# EAGLE design smart_stirrer_proto_mk2 (EAGLE 9.1.1)
CNAME: Smart Stirrer Prototype; CREVISION: MARK 2

## Sheet 1 of 3: MCU and ADC
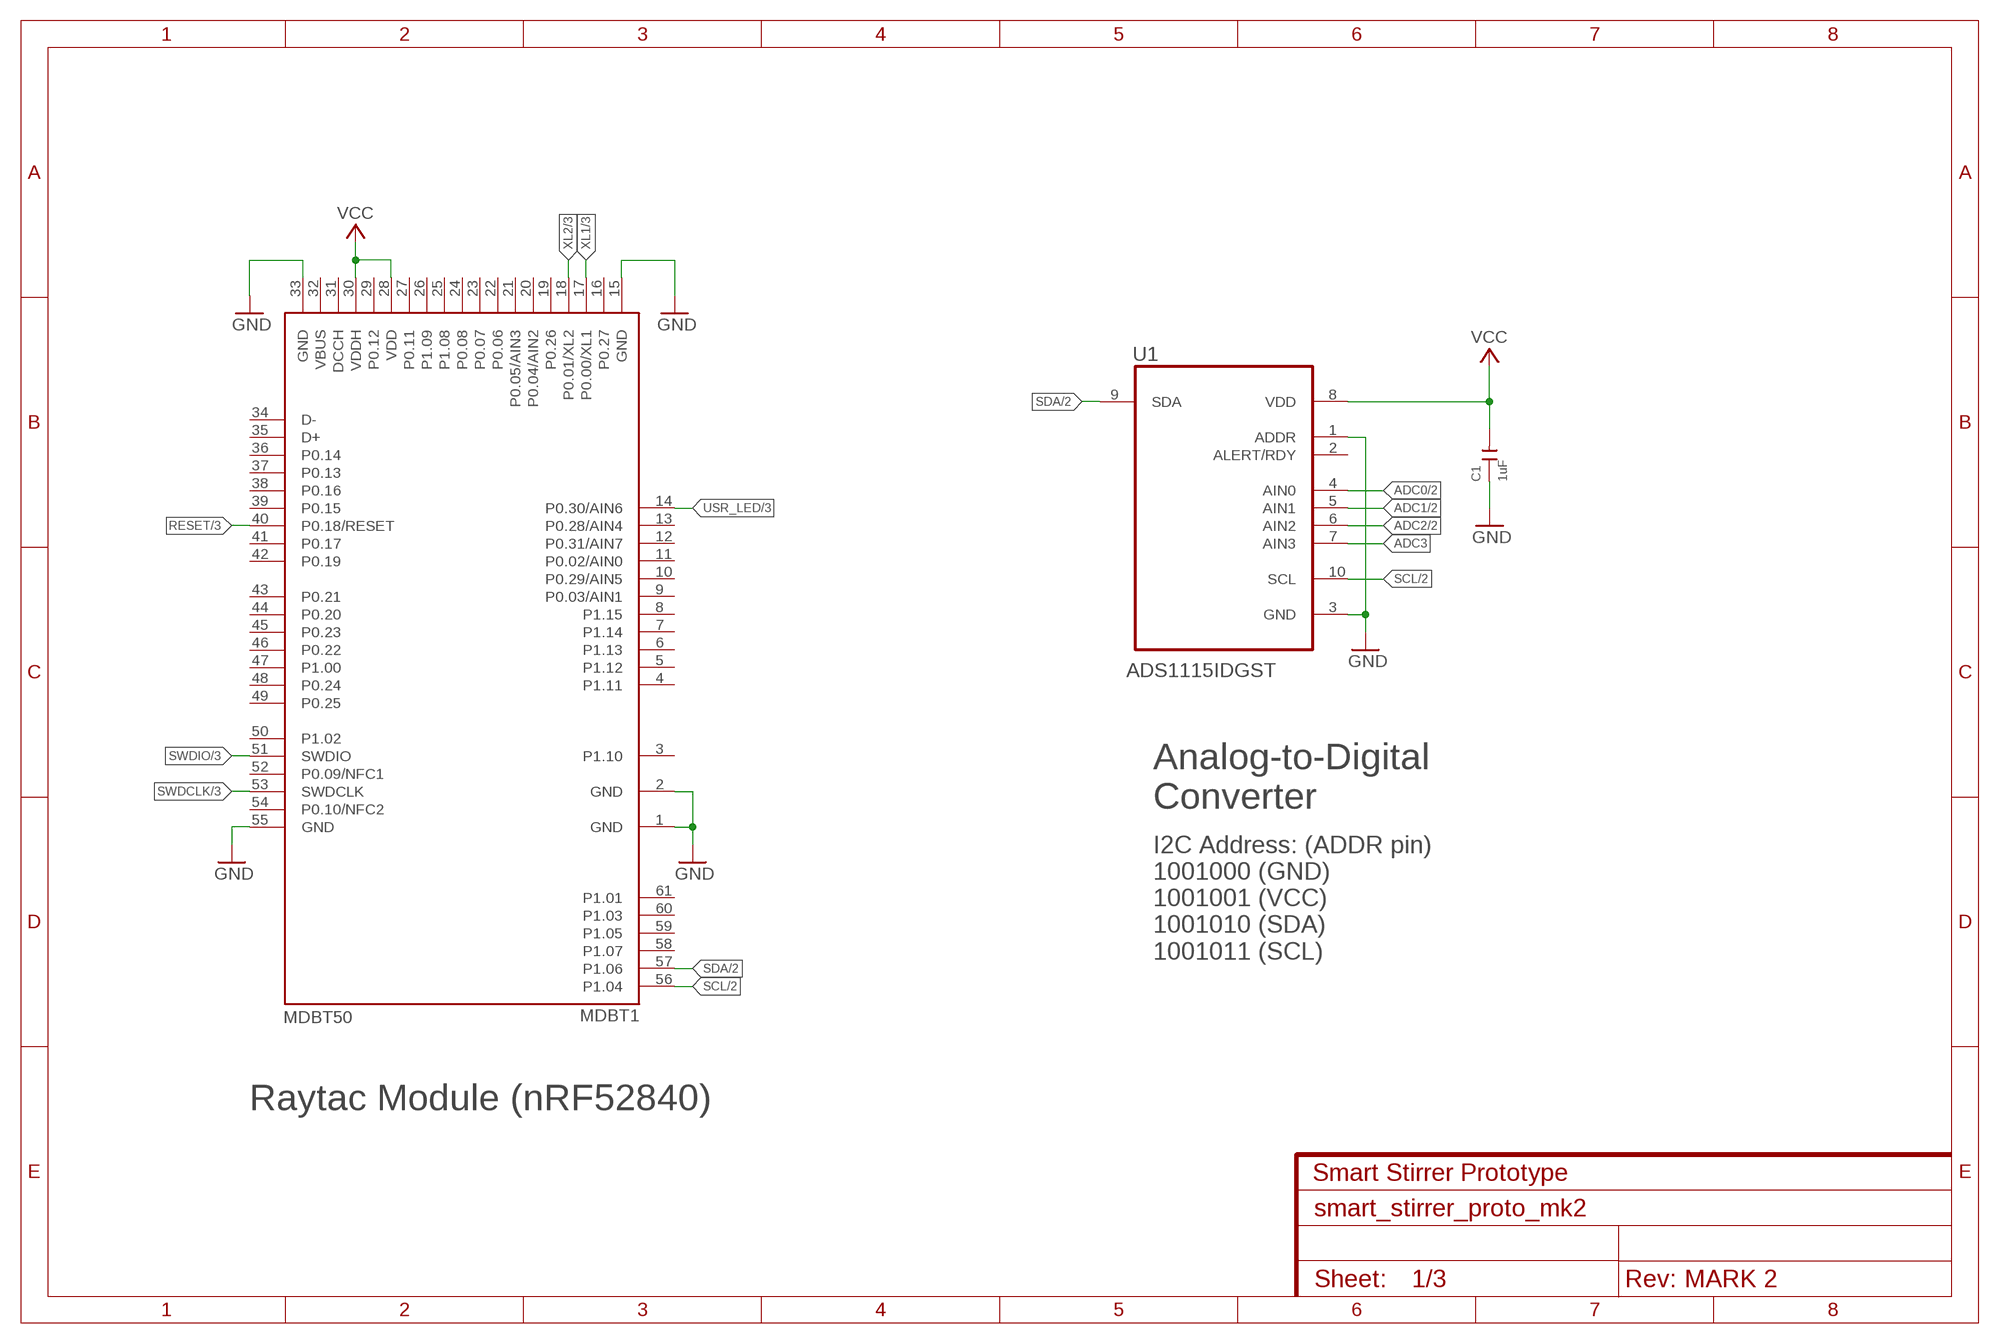
[diagram p0: schematic, sheet 1]

### Parts
C1  1uF  CERAMIC-1UF-10V-10%-X5R(0402)  [C0402]
MDBT1  MDBT50  [MDBT50]
U1  ADS1115IDGST  [SOP50P490X110-10N]

### Nets
ADC0: U1.4(AIN0) ; also sheet 2
ADC1: U1.5(AIN1) ; also sheet 2
ADC2: U1.6(AIN2) ; also sheet 2
ADC3: U1.7(AIN3)
GND: C1.1 MDBT1.1(GND) MDBT1.2(GND) MDBT1.15(GND) MDBT1.33(GND) MDBT1.55(GND) U1.1(ADDR) U1.3(GND) ; also sheet 2,3
RESET: MDBT1.40(P0.18/RESET) ; also sheet 3
SCL: MDBT1.56(P1.04) U1.10(SCL) ; also sheet 2,3
SDA: MDBT1.57(P1.06) U1.9(SDA) ; also sheet 2,3
SWDCLK: MDBT1.53(SWDCLK) ; also sheet 3
SWDIO: MDBT1.51(SWDIO) ; also sheet 3
USR_LED: MDBT1.14(P0.30/AIN6) ; also sheet 3
VCC: C1.2 MDBT1.28(VDD) MDBT1.30(VDDH) U1.8(VDD) ; also sheet 2,3
XL1: MDBT1.17(P0.00/XL1) ; also sheet 3
XL2: MDBT1.18(P0.01/XL2) ; also sheet 3
Unconnected: MDBT1.3(P1.10) MDBT1.4(P1.11) MDBT1.5(P1.12) MDBT1.6(P1.13) MDBT1.7(P1.14) MDBT1.8(P1.15) MDBT1.9(P0.03/AIN1) MDBT1.10(P0.29/AIN5) MDBT1.11(P0.02/AIN0) MDBT1.12(P0.31/AIN7) MDBT1.13(P0.28/AIN4) MDBT1.16(P0.27) MDBT1.19(P0.26) MDBT1.20(P0.04/AIN2) MDBT1.21(P0.05/AIN3) MDBT1.22(P0.06) MDBT1.23(P0.07) MDBT1.24(P0.08) MDBT1.25(P1.08) MDBT1.26(P1.09) MDBT1.27(P0.11) MDBT1.29(P0.12) MDBT1.31(DCCH) MDBT1.32(VBUS) MDBT1.34(D-) MDBT1.35(D+) MDBT1.36(P0.14) MDBT1.37(P0.13) MDBT1.38(P0.16) MDBT1.39(P0.15) MDBT1.41(P0.17) MDBT1.42(P0.19) MDBT1.43(P0.21) MDBT1.44(P0.20) MDBT1.45(P0.23) MDBT1.46(P0.22) MDBT1.47(P1.00) MDBT1.48(P0.24) MDBT1.49(P0.25) MDBT1.50(P1.02) MDBT1.52(P0.09/NFC1) MDBT1.54(P0.10/NFC2) MDBT1.58(P1.07) MDBT1.59(P1.05) MDBT1.60(P1.03) MDBT1.61(P1.01) U1.2(ALERT/RDY)

### Notes on the sheet
- Analog-to-Digital
  Converter
- I2C Address: (ADDR pin)
  1001000 (GND)
  1001001 (VCC)
  1001010 (SDA)
  1001011 (SCL)
- Raytac Module (nRF52840)

## Sheet 2 of 3: Sensors
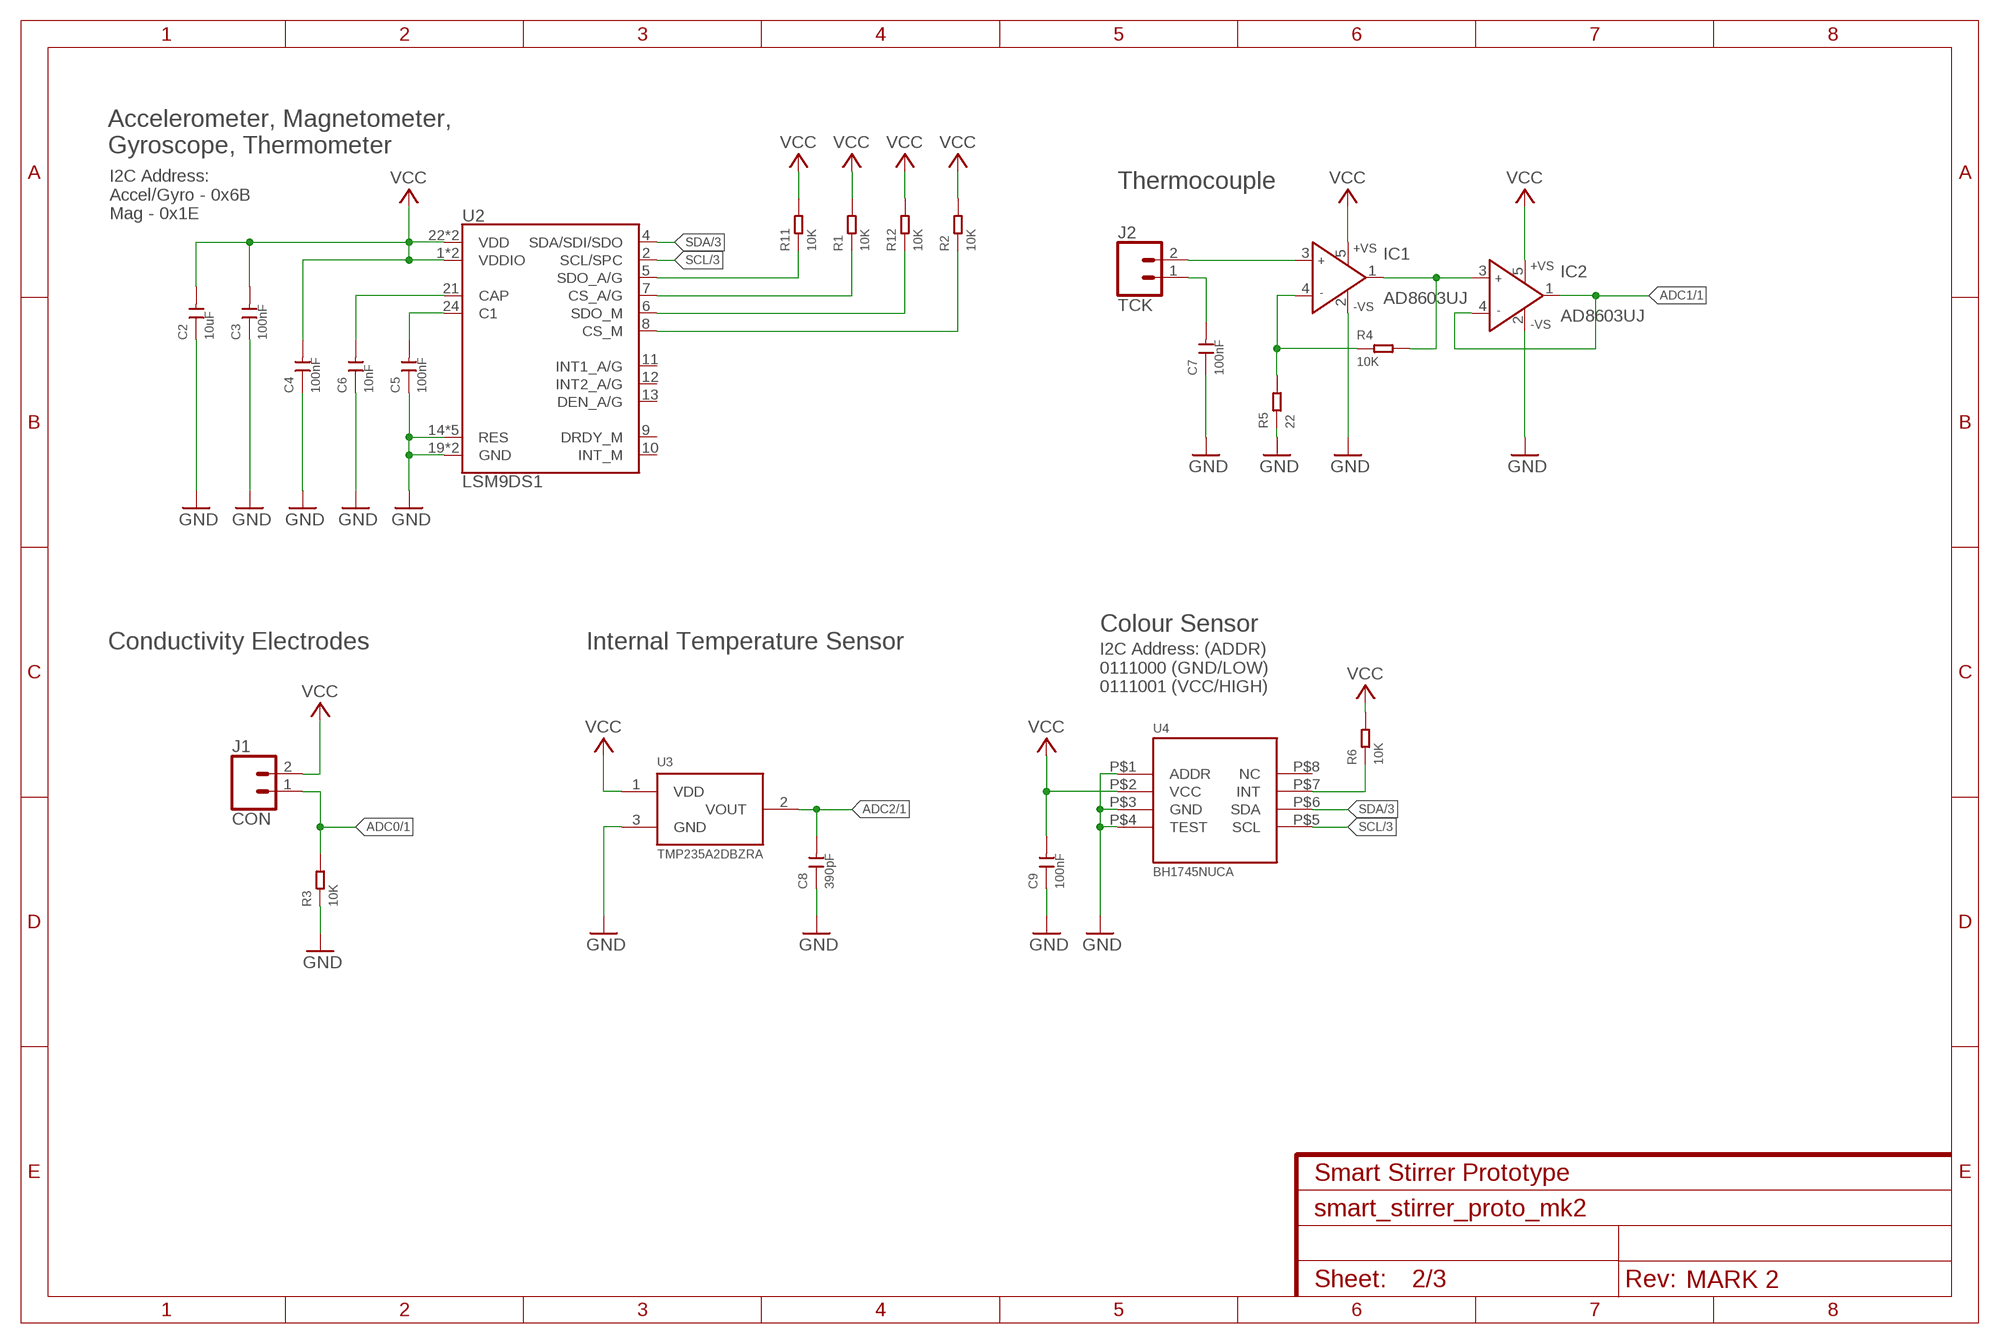
[diagram p1: schematic, sheet 2]

### Parts
C2  10uF  CERAMIC-10UF-6.3V-20%-X5R(0402)  [C0402]
C3  100nF  CERAMIC-100NF-25V-10%-X7R(0402)  [C0402]
C4  100nF  CERAMIC-100NF-25V-10%-X7R(0402)  [C0402]
C5  100nF  CERAMIC-100NF-25V-10%-X7R(0402)  [C0402]
C6  10nF  CERAMIC-10NF-50V-10%-X7R(0402)  [C0402]
C7  100nF  CERAMIC-100NF-25V-10%-X7R(0402)  [C0402]
C8  390pF  CERAMIC-390PF-50V-10%-X7R(0402)  [C0402]
C9  100nF  CERAMIC-100NF-25V-10%-X7R(0402)  [C0402]
IC1  AD8603UJ  [SOT23-5]
IC2  AD8603UJ  [SOT23-5]
J1  CON  CONN_021X02_NO_SILK  [1X02_NO_SILK]
J2  TCK  CONN_021X02_NO_SILK  [1X02_NO_SILK]
R1  10K  SMD-RES-10K-5%-1/(0402)  [R0402]
R2  10K  SMD-RES-10K-5%-1/(0402)  [R0402]
R3  10K  SMD-RES-10K-5%-1/(0402)  [R0402]
R4  10K  SMD-RES-10K-5%-1/(0402)  [R0402]
R5  22  SMD-RES-22R-5%-1/16W(0402)  [R0402]
R6  10K  SMD-RES-10K-5%-1/(0402)  [R0402]
R11  10K  SMD-RES-10K-5%-1/(0402)  [R0402]
R12  10K  SMD-RES-10K-5%-1/(0402)  [R0402]
U2  LSM9DS1  [LGA24-8X4]
U3  TMP235A2DBZRA  [SOT-23-3]
U4  BH1745NUCA  [BH1745NUC-E2]

### Nets
ADC0: J1.1 R3.2 ; also sheet 1
ADC1: IC2.1(OUT) IC2.4(IN-) ; also sheet 1
ADC2: C8.2 U3.2(VOUT) ; also sheet 1
GND: C2.1 C3.1 C4.1 C5.1 C6.1 C7.1 C8.1 C9.1 IC1.2(-VS) IC2.2(-VS) R3.1 R5.1 U2.14(RES) U2.15(RES) U2.16(RES) U2.17(RES) U2.18(RES) U2.19(GND) U2.20(GND) U3.3(GND) U4.P$1(ADDR) U4.P$3(GND) U4.P$4(TEST) ; also sheet 1,3
N$1: C5.2 U2.24(C1)
N$2: C6.2 U2.21(CAP)
N$3: IC1.1(OUT) IC2.3(IN+) R4.2
N$4: R1.1 U2.7(CS_A/G)
N$5: R2.1 U2.8(CS_M)
N$6: IC1.3(IN+) J2.2
N$7: IC1.4(IN-) R4.1 R5.2
N$8: C7.2 J2.1
N$9: R6.1 U4.P$7(INT)
N$11: R11.1 U2.5(SDO_A/G)
N$12: R12.1 U2.6(SDO_M)
SCL: U2.2(SCL/SPC) U4.P$5(SCL) ; also sheet 1,3
SDA: U2.4(SDA/SDI/SDO) U4.P$6(SDA) ; also sheet 1,3
VCC: C2.2 C3.2 C4.2 C9.2 IC1.5(+VS) IC2.5(+VS) J1.2 R1.2 R2.2 R6.2 R11.2 R12.2 U2.1(VDDIO) U2.3(VDDIO) U2.22(VDD) U2.23(VDD) U3.1(VDD) U4.P$2(VCC) ; also sheet 1,3
Unconnected: U2.9(DRDY_M) U2.10(INT_M) U2.11(INT1_A/G) U2.12(INT2_A/G) U2.13(DEN_A/G) U4.P$8(NC)

### Notes on the sheet
- Accelerometer, Magnetometer,
  Gyroscope, Thermometer
- Thermocouple
- I2C Address: 
  Accel/Gyro - 0x6B
  Mag - 0x1E
- Colour Sensor
- Conductivity Electrodes | Internal Temperature Sensor
- I2C Address: (ADDR)
  0111000 (GND/LOW)
  0111001 (VCC/HIGH)

## Sheet 3 of 3: Power and Headers
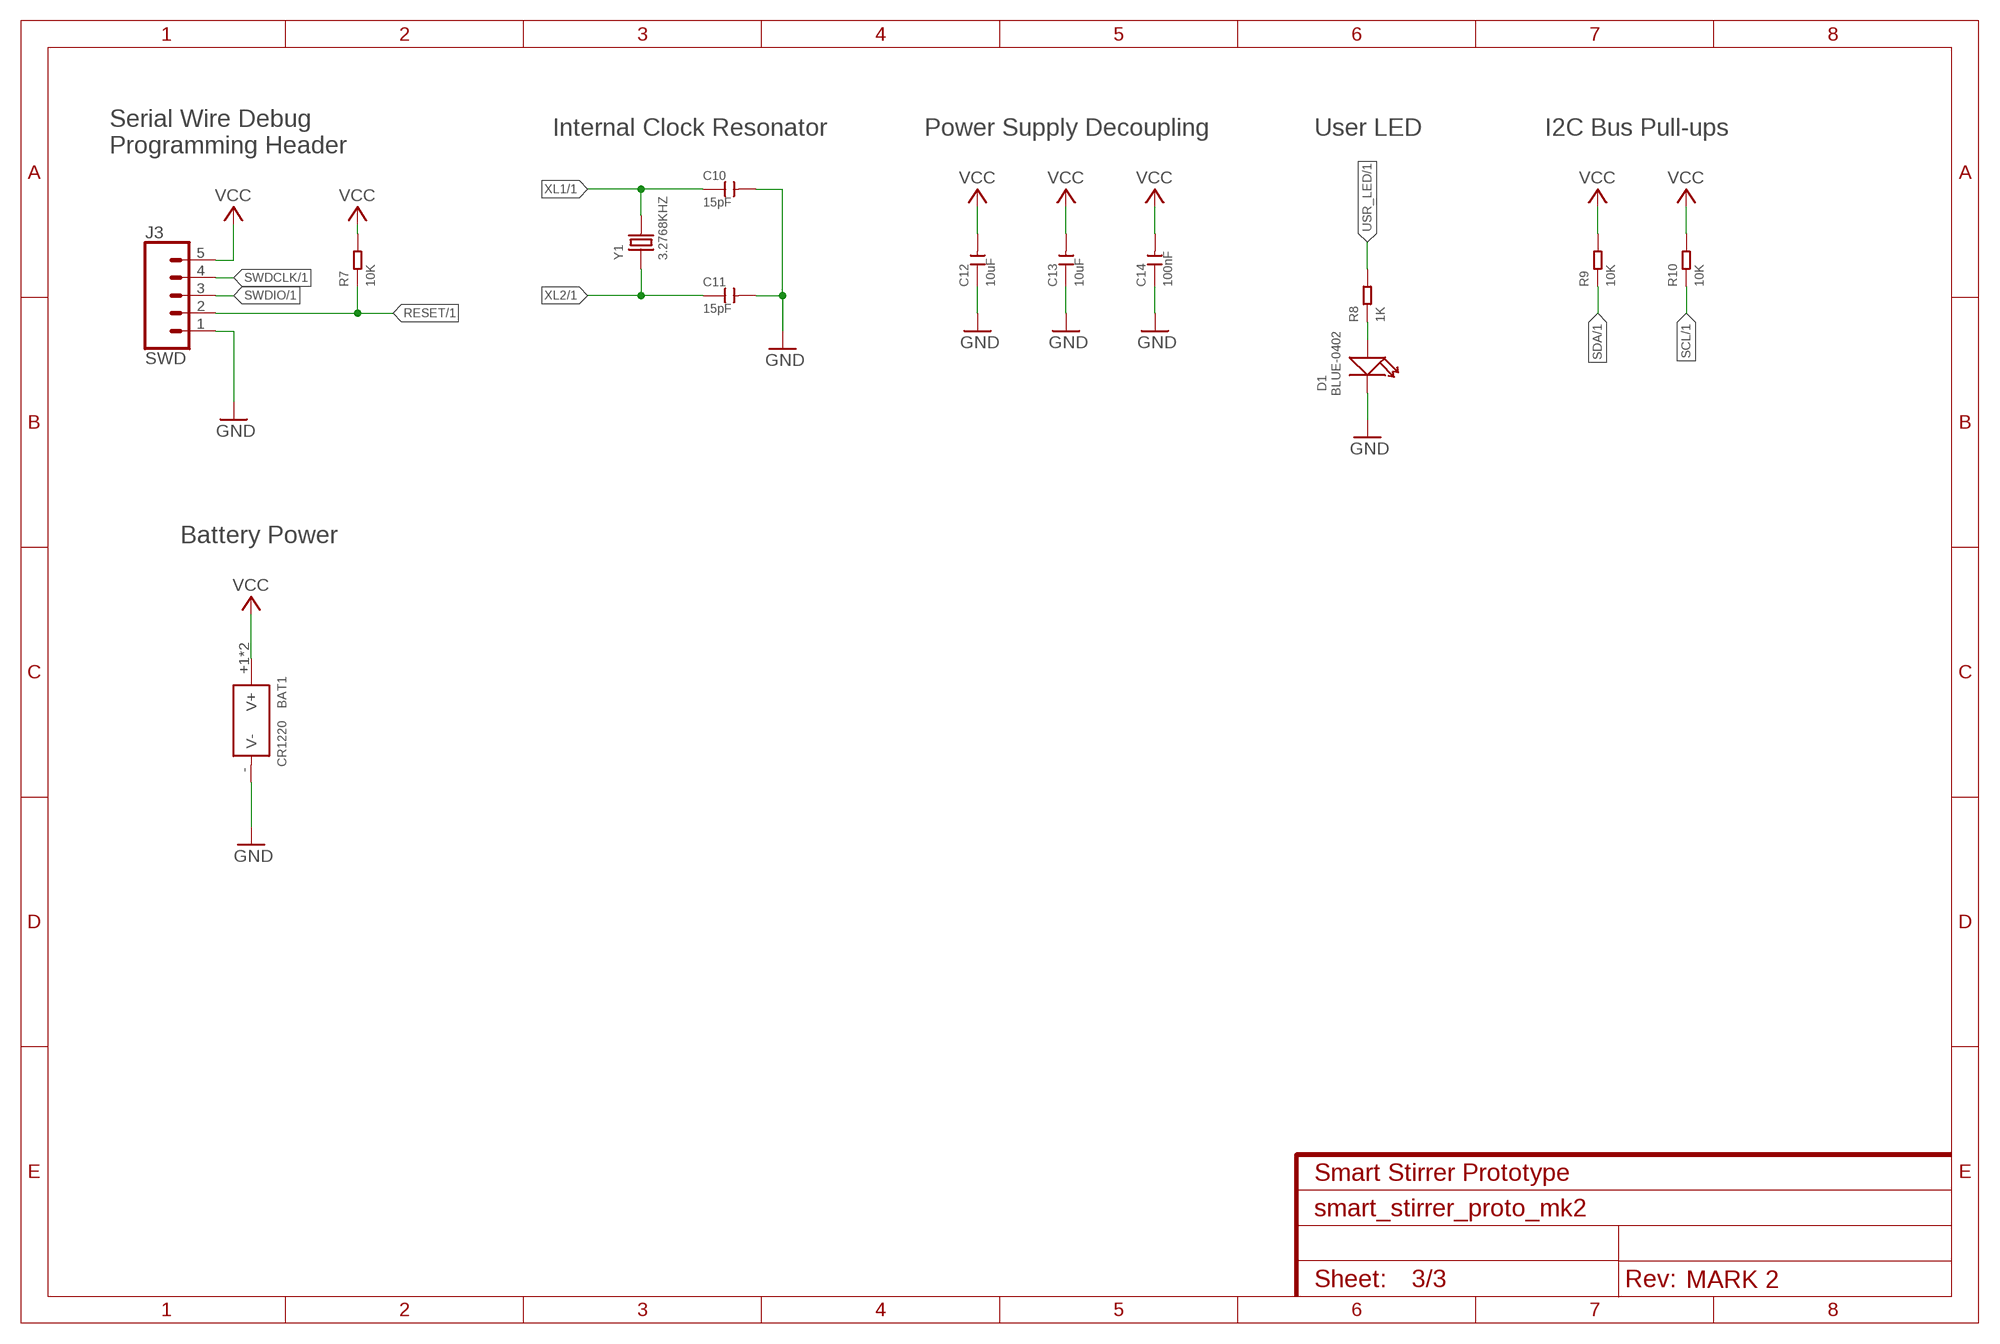
[diagram p2: schematic, sheet 3]

### Parts
BAT1  CR1220  DIP-BATTERY-CELL-HOLDER(1220)  [BAT2P-13.5-CR1220]
C10  15pF  CERAMIC-15PF-50V-5%-NPO(0402)  [C0402]
C11  15pF  CERAMIC-15PF-50V-5%-NPO(0402)  [C0402]
C12  10uF  CERAMIC-10UF-6.3V-20%-X5R(0402)  [C0402]
C13  10uF  CERAMIC-10UF-6.3V-20%-X5R(0402)  [C0402]
C14  100nF  CERAMIC-100NF-25V-10%-X7R(0402)  [C0402]
D1  BLUE-0402  SMD-LED-CLEAR-BLUE(0402)  [LED-0402]
J3  SWD  CONN_05NO_SILK  [1X05_NO_SILK]
R7  10K  SMD-RES-10K-5%-1/(0402)  [R0402]
R8  1K  SMD-RES-1K-5%-1/16W(0402)  [R0402]
R9  10K  SMD-RES-10K-5%-1/(0402)  [R0402]
R10  10K  SMD-RES-10K-5%-1/(0402)  [R0402]
Y1  3.2768KHZ  SMD-CRYSTAL-32.768KHZ-12.5PF-20PPM-90K(2P-L2.0X1.2MM)  [X2-SMD-L2.0X1.2X0.55MM]

### Nets
GND: BAT1.-(V-) C10.2 C11.2 C12.1 C13.1 C14.1 D1.- J3.1 ; also sheet 1,2
N$10: D1.+ R8.1
RESET: J3.2 R7.1 ; also sheet 1
SCL: R10.1 ; also sheet 1,2
SDA: R9.1 ; also sheet 1,2
SWDCLK: J3.4 ; also sheet 1
SWDIO: J3.3 ; also sheet 1
USR_LED: R8.2 ; also sheet 1
VCC: BAT1.+1(V+) BAT1.+2(V+) C12.2 C13.2 C14.2 J3.5 R7.2 R9.2 R10.2 ; also sheet 1,2
XL1: C10.1 Y1.2 ; also sheet 1
XL2: C11.1 Y1.1 ; also sheet 1

### Notes on the sheet
- Internal Clock Resonator | Power Supply Decoupling | User LED | I2C Bus Pull-ups
- Serial Wire Debug
  Programming Header
- Battery Power

## Library data of the parts
BAT1 = OPL_Connector:DIP-BATTERY-CELL-HOLDER(1220): 320170002; VALUE: cr1220
C1 = OPL_Capacitor:CERAMIC-1UF-10V-10%-X5R(0402): 302010040; MPN: CC0402KRX5R6BB105; VALUE: 1uf
C2 C12 C13 = OPL_Capacitor:CERAMIC-10UF-6.3V-20%-X5R(0402): 302010053; MPN: CC0402MRX5R5BB106; VALUE: 10uf
C3-C5 C7 C9 C14 = OPL_Capacitor:CERAMIC-100NF-25V-10%-X7R(0402): 302010024; MPN: CC0402KRX7R8BB104; VALUE: 100nf
C6 = OPL_Capacitor:CERAMIC-10NF-50V-10%-X7R(0402): 302010006; MPN: CC0402KRX7R9BB103; VALUE: 10nf
C8 = OPL_Capacitor:CERAMIC-390PF-50V-10%-X7R(0402): 302010260; MPN: CC0402KRX7R9BB391; VALUE: 390PF 50V
C10 C11 = OPL_Capacitor:CERAMIC-15PF-50V-5%-NPO(0402): 302010041; MPN: GRM1555C1H150JA01D; VALUE: 15pf
D1 = OPL_Optoelectronics:SMD-LED-CLEAR-BLUE(0402): 304090075; MPN: BL-HB337A-AV-TRB
IC1 IC2 = analog-devices:AD8603: Precision Micropower, Low Noise CMOS, Rail-to-Rail Input/Output Operational Amplifiers Source: http://www.analog.com/static/imported-files/data_sheets/AD8603_8607_8609.pdf; MF: ALTERA CORPORATION; MPN: AD8603AUJZ-REEL7; OC_FARNELL: 1651290; OC_NEWARK: 59K6904
J1 J2 = SparkFun-Connectors:CONN_02: Multi connection point. Often used as Generic Header-pin footprint for 0.1 inch spaced/style header connections On any of the 0.1 inch spaced packages, you can populate with these: Break Away Headers - Straight <https://www.sparkfun.com/products/116> (PRT-00116) Break Away Male Headers - Right Angle <https://www.sparkfun.com/products/553> (PRT-00553) Female Headers <https://www.sparkfun.com/products/115> (PRT-00115) Break Away Headers - Machine Pin <https://www.sparkfun.com/products/117> (PRT-00117) Break Away Female Headers - Swiss Machine Pin <https://www.sparkfun.com/products/743> (PRT-00743) For SCREWTERMINALS and SPRING TERMINALS visit here: Screw Terimnals on SparkFun.com <https://www.sparkfun.com/search/results?term=Screw+Terminals> (5mm/3.5mm/2.54mm spacing) This device is also useful as a general connection point to wire up your design to another part of your project. Our various solder wires solder well into these plated through hole pads. Hook-Up Wire - Assortment (Stranded, 22 AWG) <https://www.sparkfun.com/products/11375> (PRT-11375) Hook-Up Wire - Assortment (Solid Core, 22 AWG) <https://www.sparkfun.com/products/11367> (PRT-11367) View the entire wire category on our website here <https://www.sparkfun.com/categories/141> Special notes: Molex polarized connector foot print use with: PRT-08233 with associated crimp pins and housings. 2.54_SCREWTERM for use with PRT-10571. 3.5mm Screw Terminal footprints for PRT-08084 5mm Screw Terminal footprints for use with PRT-08432
J3 = SparkFun-Connectors:CONN_05: Multi connection point. Often used as Generic Header-pin footprint for 0.1 inch spaced/style header connections On any of the 0.1 inch spaced packages, you can populate with these: Break Away Headers - Straight <https://www.sparkfun.com/products/116> (PRT-00116) Break Away Male Headers - Right Angle <https://www.sparkfun.com/products/553> (PRT-00553) Female Headers <https://www.sparkfun.com/products/115> (PRT-00115) Break Away Headers - Machine Pin <https://www.sparkfun.com/products/117> (PRT-00117) Break Away Female Headers - Swiss Machine Pin <https://www.sparkfun.com/products/743> (PRT-00743) For SCREWTERMINALS and SPRING TERMINALS visit here: Screw Terimnals on SparkFun.com <https://www.sparkfun.com/search/results?term=Screw+Terminals> (5mm/3.5mm/2.54mm spacing) This device is also useful as a general connection point to wire up your design to another part of your project. Our various solder wires solder well into these plated through hole pads. Hook-Up Wire - Assortment (Stranded, 22 AWG) <https://www.sparkfun.com/products/11375> (PRT-11375) Hook-Up Wire - Assortment (Solid Core, 22 AWG) <https://www.sparkfun.com/products/11367> (PRT-11367) View the entire wire category on our website here <https://www.sparkfun.com/categories/141> Special notes: Molex polarized connector foot print use with SKU : PRT-08231 with associated crimp pins and housings. 1MM SMD Version SKU: PRT-10208
MDBT1 = MDBT50Q_171031:MDBT50: Raytac Corporation MDBT50 Bluetooth Low Energy Module based on Noridc nRF52840 Source: Raytac datasheet
R1-R4 R6 R7 R9-R12 = OPL_Resistor:SMD-RES-10K-5%-1/(0402): 301010004; MPN: RC0402JR-0710KL
R5 = OPL_Resistor:SMD-RES-22R-5%-1/16W(0402): 301012020; MPN: RC0402JR-070RL; VALUE: 0R
R8 = OPL_Resistor:SMD-RES-1K-5%-1/16W(0402): 301012016; MPN: RC0402JR-071KL
U1 = ADS1115IDGST:ADS1115IDGST: Analog-to-Digital Converter with Internal Reference; AVAILABILITY: Unavailable; DESCRIPTION: 16-Bit ADC with Integrated MUX, PGA, Comparator, Oscillator, and Reference 10-VSSOP -40 to 125; MF: Texas Instruments; MP: ADS1115IDGST; PACKAGE: MSOP-10 Texas Instruments; PRICE: None
U2 = LSM9DS1_temp:LSM9DS1: LSM9DS1 3D accelerometer, gyroscope & magnetometer The LSM9DS1 is a system-in-package featuring a 3D digital linear acceleration sensor, a 3D digital angular rate sensor, and a 3D digital magnetic sensor. The LSM9DS1 has a linear acceleration full scale of ±2g/±4g/±8/±16 g, a magnetic field full scale of ±4/±8/±12/±16 gauss and an angular rate of ±245/±500/±2000 dps. The LSM9DS1 includes an I2 C serial bus interface supporting standard and fast mode (100 kHz and 400 kHz) and an SPI serial standard interface. Magnetic, accelerometer and gyroscope sensing can be enabled or set in power-down mode separately for smart power management. The LSM9DS1 is available in a plastic land grid array package (LGA) and it is guaranteed to operate over an extended temperature range from -40 °C to +85 °C.; PROD_ID: IC-12536
U3 = TMP235A2DBZR:TMP235A2DBZR
U4 = BH1745NUC:BH1745NUC
Y1 = OPL_Crystal Oscillator:SMD-CRYSTAL-32.768KHZ-12.5PF-20PPM-90K(2P-L2.0X1.2MM): 306010020; MPN: FC-12M

## Board
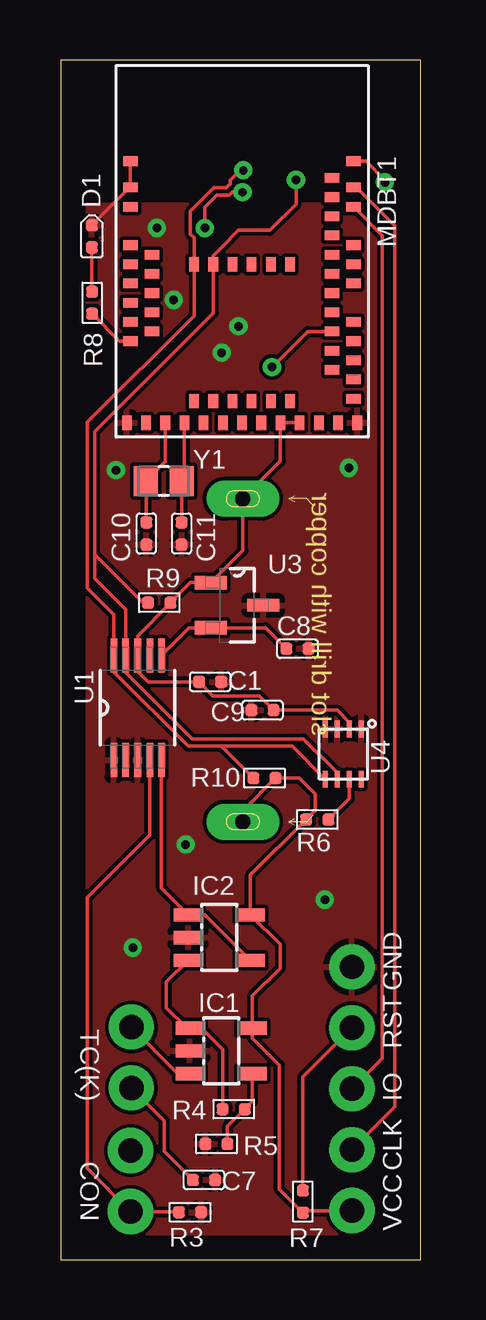
[diagram p3: board, top side]
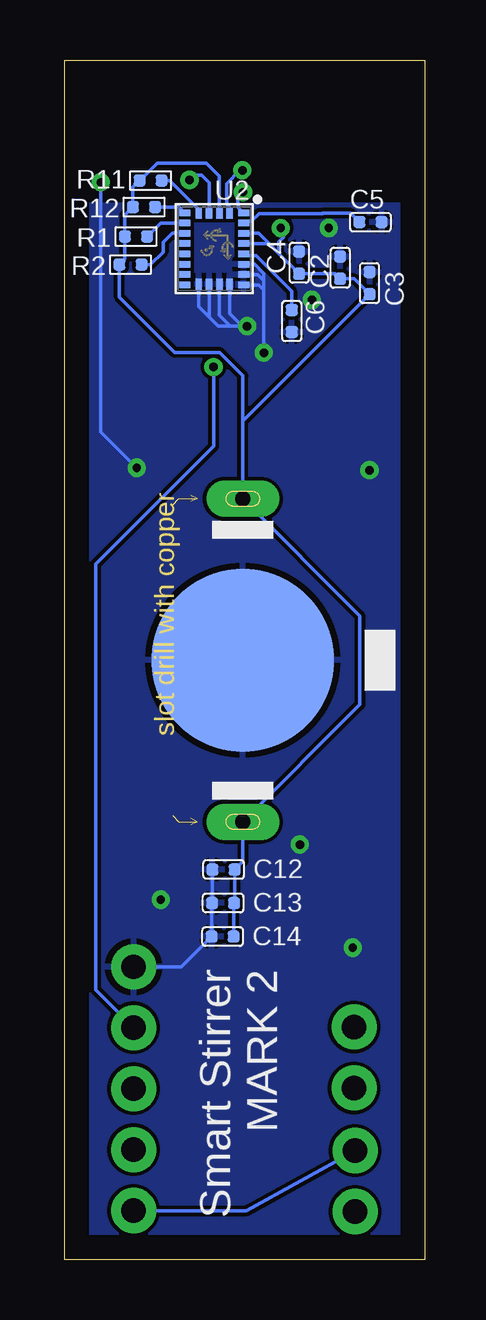
[diagram p4: board, bottom side, seen from below]

Size 15 x 50 mm. Coordinates in mm from the lower left corner, seen from the top.
Outline: 0,0 15,0 15,50 0,50 0,0
Copper layers (1*16): Top 0.035mm / dielectric 1.5mm / Bottom 0.035mm
Design rules "default": minimum track width 6mil, minimum drill 0.35mm, track to track 6mil, track to pad 6mil, pad to pad 6mil, via to via 6mil, smd to smd 6mil, copper to edge 40mil, drill to drill 6mil, minimum pad ring 10mil, minimum via ring 8mil, stop-mask expansion 4mil, vias tented up to drill 0mil, thermal gap 10mil

### Footprints (pad centres in the part's own frame; a part is rotated, then mirrored left to right if it is on the bottom)
BAT2P-13.5-CR1220 = drill 0.635 pad 1.524 long: +1 6.731,0; +2 -6.731,0 | smd 7.62 x 7.62: - 0,0
C0402 = smd 0.5 x 0.5: 1 0,0.463; 2 0,-0.463
LED-0402 = smd 0.5 x 0.5: + -0.463,0; - 0.463,0
SOT23-5 = smd 0.55 x 1.2: 1 -0.95,-1.3; 2 0,-1.3; 3 0.95,-1.3; 4 0.95,1.3; 5 -0.95,1.3
1X02_NO_SILK = drill 1.016 pad 1.88: 1 0,0; 2 2.54,0
1X05_NO_SILK = drill 1.016 pad 1.88: 1 0,0; 2 2.54,0; 3 5.08,0; 4 7.62,0; 5 10.16,0
MDBT50 = smd 0.6 x 0.4: 1 -4.65,3.75; 2 -4.65,2.65; 3 -4.65,1.85; 4 -4.65,0.25; 5 -3.75,-0.15; 6 -4.65,-0.55; 7 -3.75,-0.95; 8 -4.65,-1.35; 9 -3.75,-1.75; 10 -4.65,-2.15; 11 -3.75,-2.55; 12 -4.65,-2.95; 13 -3.75,-3.35; 14 -4.65,-3.75; 34 4.65,-6.15; 35 4.65,-5.35; 36 3.75,-4.95; 37 4.65,-4.55; 38 3.75,-4.15; 39 4.65,-3.75; 40 3.75,-3.35; 41 4.65,-2.95; 42 3.75,-2.55; 43 3.75,-1.75; 44 4.65,-1.35; 45 3.75,-0.95; 46 4.65,-0.55; 47 3.75,-0.15; 48 4.65,0.25; 49 3.75,0.65; 50 3.75,1.45; 51 4.65,1.85; 52 3.75,2.25; 53 4.65,2.65; 54 3.75,3.05; 55 4.65,3.75 | smd 0.4 x 0.6: 15 -4.8,-7.15; 16 -4,-7.15; 17 -3.2,-7.15; 18 -2.4,-7.15; 19 -2,-6.25; 20 -1.6,-7.15; 21 -1.2,-6.25; 22 -0.8,-7.15; 23 -0.4,-6.25; 24 0,-7.15; 25 0.4,-6.25; 26 0.8,-7.15; 27 1.2,-6.25; 28 1.6,-7.15; 29 2,-6.25; 30 2.4,-7.15; 31 3.2,-7.15; 32 4,-7.15; 33 4.8,-7.15; 56 -2,-0.55; 57 -1.2,-0.55; 58 -0.4,-0.55; 59 0.4,-0.55; 60 1.2,-0.55; 61 2,-0.55
R0402 = smd 0.5 x 0.5: 1 0,0.463; 2 0,-0.463
SOP50P490X110-10N = smd 1.422 x 0.279: 1 -2.184,0.991; 2 -2.184,0.508; 3 -2.184,0; 4 -2.184,-0.508; 5 -2.184,-0.991; 6 2.184,-0.991; 7 2.184,-0.508; 8 2.184,0; 9 2.184,0.508; 10 2.184,0.991
LGA24-8X4 = smd 0.27 x 0.45: 1 -1.505,1.225; 6 -1.505,-1.225; 7 -1.075,-1.225; 8 -0.645,-1.225; 9 -0.215,-1.225; 10 0.215,-1.225; 11 0.645,-1.225; 12 1.075,-1.225; 13 1.505,-1.225; 18 1.505,1.225; 19 1.075,1.225; 20 0.645,1.225; 21 0.215,1.225; 22 -0.215,1.225; 23 -0.645,1.225; 24 -1.075,1.225 | smd 0.45 x 0.27: 2 -1.475,0.645; 3 -1.475,0.215; 4 -1.475,-0.215; 5 -1.475,-0.645; 14 1.475,-0.645; 15 1.475,-0.215; 16 1.475,0.215; 17 1.475,0.645
SOT-23-3 = smd 1.321 x 0.559: 1 -1.092,0.94; 2 -1.092,-0.94 | smd 1.321 x 0.508: 3 1.092,0
BH1745NUC-E2 = smd 0.7 x 0.2: P$1 0,-0.25; P$2 0,-0.75; P$3 0,-1.25; P$4 0,-1.75; P$5 2.1,-1.75; P$6 2.1,-1.25; P$7 2.1,-0.75; P$8 2.1,-0.25
X2-SMD-L2.0X1.2X0.55MM = smd 1 x 1.25: 1 -0.75,0; 2 0.75,0

### Placement (x,y rotation side)
BAT1  7.58,24.98 270 bottom
C1  6.22,24.08 270 top
C2  3.52,41.34 0 bottom
C3  2.3,40.7 0 bottom
C4  5.23,41.55 0 bottom
C5  2.26,43.24 270 bottom
C6  5.54,39.12 180 bottom
C7  5.96,3.32 270 top
C8  9.86,25.46 270 top
C9  8.4,22.9 90 top
C10  3.56,30.26 0 top
C11  5.03,30.26 0 top
C12  8.38,16.26 90 bottom
C13  8.4,14.86 90 bottom
C14  8.42,13.46 90 bottom
D1  1.29,42.65 90 top
IC1  6.68,8.7 270 top
IC2  6.6,13.42 270 top
J1  2.9,2 90 top
J2  2.94,7.15 90 top
J3  12.13,12.2 270 top
MDBT1  7.55,42.03 0 top
R1  12.03,42.64 270 bottom
R2  12.26,41.47 270 bottom
R3  5.38,1.97 270 top
R4  7.2,6.27 270 top
R5  6.48,4.82 90 top
R6  10.68,18.34 270 top
R7  10.08,2.42 0 top
R8  1.3,39.88 0 top
R9  4.1,27.38 90 top
R10  8.48,20.07 90 top
R11  11.42,44.97 270 bottom
R12  11.7,43.87 270 bottom
U1  3.2,23 90 top
U2  8.77,42.13 270 bottom
U3  7.34,27.27 0 top
U4  12.77,22.12 270 top
Y1  4.28,32.45 180 top

### Tracks (layer width: path | path; a pad name or v marks a point on that pad's centre or on a via)
ADC0
  Top 0.152: R3.2 4.89,2 J1.1 1.09,3.81 1.09,15.09 3.71,17.71 U1.4
ADC1
  Top 0.152: U1.5 4.19,15.48 IC2.1 6,14.37 IC2.4
ADC2
  Top 0.152: U1.6 5.34,26.33 U3.2 8.53,26.33 C8.2
GND  (via drill 0.35)
  Top 0.152: MDBT1.1 MDBT1.2 2.86,44.68 D1.- | MDBT1.55 12.72,45.78 13.5,45 v13.5,44.9
  Bottom 0.152: BAT1.- 5.7,26.86 | C12.1 8.86,16.24 C13.1 8.88,14.84 C14.1 10.14,12.2 J3.1 | U2.20 7.08,41.48 6.7,41.1 6.7,40.8 | 6.7,40.8 6.7,40.4 | U2.19 6.96,41.05 6.7,40.8 | U2.18 6.92,40.62 6.7,40.4 | 6.7,40.4 v6.7,37.8 | U2.14 9.41,39.72 8.98,39.28 | 8.98,39.28 8.6,38.9 8.1,38.9 | 8.1,38.9 7.6,38.9 | 7.6,38.9 v7.4,38.9 | U2.15 8.98,39.28 | U2.16 8.55,39.35 8.1,38.9 | U2.17 8.12,39.42 7.6,38.9 | v13.5,44.9 13.5,34.5 v12,33
  other vias: 2.3,32.9 4,43 3,13 5.2,17.3 4.7,40 11,15
  pour Top: 0,44 15,44 15,0 0,0
  pour Bottom: 0,44 15,44 15,0 0,0
N$1
  Bottom 0.152: C5.2 3.09,43.61 4.25,43.61 4.26,43.6 6.9,43.6 7.22,43.27 7.48,43.27 U2.24
N$2
  Bottom 0.152: U2.21 7.48,41.85 7.02,41.85 6.08,40.92 5.54,40.37 C6.2
N$3
  Top 0.152: IC2.3 4.4,11.57 4.4,10.5 5.25,9.65 IC1.1 5.85,9.65 6.74,8.76 R4.2
N$4
  Bottom 0.152: 10.06,43.14 U2.7 11.01,43.2 R1.1
N$5
  Bottom 0.152: U2.8 10.53,42.77 10.9,42.4 10.9,42 11.43,41.47 R2.1
N$6
  Top 0.152: J2.2 4.88,7.75 IC1.3
N$7
  Top 0.152: IC1.4 7.98,6.59 R4.1 6.94,5.55 R5.2
N$8
  Top 0.152: J2.1 4.3,5.79 4.3,4.52 C7.2
N$9
  Top 0.152: R6.1 12.02,19.22 U4.P$7
N$10
  Top 0.152: D1.+ 1.29,40.35 R8.1
N$11
  Bottom 0.152: R11.1 10.63,44.97 9.41,43.76 U2.5
N$12
  Bottom 0.152: U2.6 10.23,43.87 R12.1
RESET  (via drill 0.35)
  Top 0.152: R7.1 10.08,7.61 J3.2 | v8.8,37.2 10.28,38.68 MDBT1.40
  Bottom 0.152: J3.2 13.7,11.23 13.7,29 8.8,33.9 v8.8,37.2
SCL  (via drill 0.35)
  Top 0.152: U4.P$5 9.64,21.4 6.69,21.4 | 6.69,21.4 5.3,21.4 2.21,24.49 U1.10 2.21,26.89 1.1,28 1.1,34.9 5.55,39.35 MDBT1.56 5.55,42.59 5.39,42.74 5.39,43.69 6.37,44.67 6.89,44.67 7.07,44.85 7.07,45 7.47,45.4 v7.6,45.4 | R10.1 6.69,21.4
  Bottom 0.152: v7.6,45.4 7.7,45.4 8.25,44.85 8.25,43.98 8.12,43.86 U2.2
SDA  (via drill 0.35)
  Top 0.152: 2.7,25.19 2.7,27.1 1.41,28.39 1.41,29.39 | 2.7,25.19 U1.9 | U4.P$6 11.52,20.29 10.11,21.7 5.46,21.7 2.7,24.47 2.7,25.19 | R9.1 3.42,27.38 1.41,29.39 | 1.41,29.39 1.41,34.51 6.35,39.45 MDBT1.57 6.35,41.85 6.75,42.25 7.4,42.9 8.7,42.9 9.8,44 v9.8,45
  Bottom 0.152: v9.8,45 9.6,45.2 9.3,45.2 8.98,44.88 U2.4
SWDCLK
  Top 0.152: MDBT1.53 12.32,44.68 13.91,43.09 13.91,6.36 J3.4
SWDIO
  Top 0.152: MDBT1.51 13.4,42.68 13.4,8.39 J3.3
USR_LED
  Top 0.152: R8.2 2.44,38.28 MDBT1.14
VCC  (via drill 0.35)
  Top 0.152: MDBT1.30 MDBT1.28 9.15,33.28 BAT1.+2 7.58,29.54 U3.1 5.39,28.21 R9.2 4.56,27.36 3.2,26 U1.8 3.2,24.52 3.64,24.08 C1.2 6.34,23.5 8.26,23.5 C9.2 11.51,22.9 12.02,22.39 U4.P$2 | 10.13,18.25 R6.2 | J3.5 10.16,2.04 R7.2 9.1,2.94 9.1,8.1 7.98,9.22 IC1.5 7.98,10.98 9.13,12.13 9.13,13.13 IC2.5 7.9,16.02 R6.2 | R6.2 10.6,18.72 10.6,19.4 9.93,20.07 R10.2 7.58,18.71 BAT1.+1 | v6,42.99 6,43.87 6.5,44.37 7.02,44.37 7.14,44.49 v7.57,44.49
  Bottom 0.152: J3.5 7.43,2.04 J1.2 | C14.2 7.96,14.84 C13.2 7.92,14.88 C12.2 7.58,16.6 BAT1.+1 2.7,23.13 2.7,26.83 BAT1.+2 7.58,35 | 7.58,35 7.58,36.84 8.55,37.81 10.41,37.81 12.72,40.12 R2.2 12.49,41.7 R1.2 12.49,43.54 R12.2 12.16,44.69 R11.2 11.15,45.7 9.1,45.7 8.55,45.16 U2.3 | 6.07,41.93 C4.2 3.73,41.09 C2.2 2.94,40.88 C3.2 7.54,35 7.58,35 | 6.07,41.93 6.49,42.34 | 6.49,42.34 U2.22 | 6.49,42.34 6.92,42.77 U2.23 | 6.07,41.93 6.07,42.43 5.9,42.6 5.9,42.89 v6,42.99 | v7.57,44.49 7.8,44.26 7.8,43.96 7.76,43.92 7.76,43.85 U2.1
XL1
  Top 0.152: 3.53,30.75 C10.1 3.56,32.42 Y1.2 4.35,33.27 MDBT1.17 4.35,34.75
XL2
  Top 0.152: Y1.1 | Y1.1 5.14,32.56 | 4.85,32.63 Y1.1 | 4.75,32.73 Y1.1 | MDBT1.18 5.15,32.57 Y1.1 | Y1.1 C11.1

### Text on the board
tPlace: GND | TC(K) | RST | IO | CON | CLK | VCC
bPlace: Smart Stirrer / MARK 2